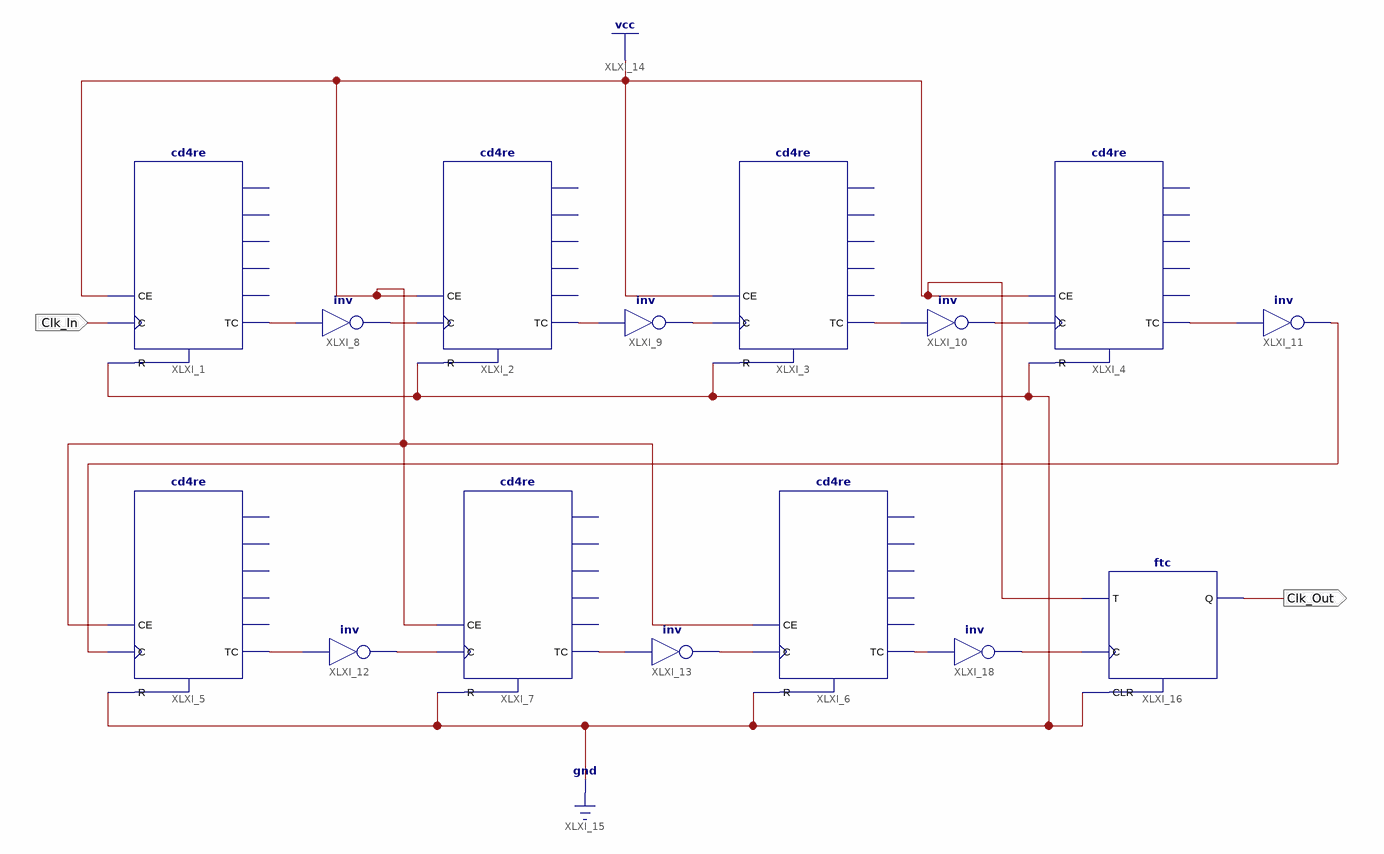
[diagram p0: schematic sheet 1]
// Xilinx ISE schematic Divider.sch (spartan6) as structural Verilog: 15 symbols, 2 ports
module Divider (
  input  Clk_In,
  output Clk_Out
);

  wire XLXN_1, XLXN_2, XLXN_3, XLXN_4, XLXN_5, XLXN_6, XLXN_7, XLXN_8, XLXN_9, XLXN_10, XLXN_11, XLXN_12,
       XLXN_30, XLXN_31;

  cd4re XLXI_1 (.C(Clk_In), .CE(1'b1), .R(1'b0), .TC(XLXN_10));  // open: CEO, Q0, Q1, Q2, Q3
  cd4re XLXI_2 (.C(XLXN_11), .CE(1'b1), .R(1'b0), .TC(XLXN_8));  // open: CEO, Q0, Q1, Q2, Q3
  cd4re XLXI_3 (.C(XLXN_9), .CE(1'b1), .R(1'b0), .TC(XLXN_6));  // open: CEO, Q0, Q1, Q2, Q3
  cd4re XLXI_4 (.C(XLXN_7), .CE(1'b1), .R(1'b0), .TC(XLXN_12));  // open: CEO, Q0, Q1, Q2, Q3
  cd4re XLXI_5 (.C(XLXN_1), .CE(1'b1), .R(1'b0), .TC(XLXN_2));  // open: CEO, Q0, Q1, Q2, Q3
  cd4re XLXI_6 (.C(XLXN_5), .CE(1'b1), .R(1'b0), .TC(XLXN_30));  // open: CEO, Q0, Q1, Q2, Q3
  cd4re XLXI_7 (.C(XLXN_3), .CE(1'b1), .R(1'b0), .TC(XLXN_4));  // open: CEO, Q0, Q1, Q2, Q3
  not XLXI_8 (XLXN_11, XLXN_10);
  not XLXI_9 (XLXN_9, XLXN_8);
  not XLXI_10 (XLXN_7, XLXN_6);
  not XLXI_11 (XLXN_1, XLXN_12);
  not XLXI_12 (XLXN_3, XLXN_2);
  not XLXI_13 (XLXN_5, XLXN_4);
  ftc XLXI_16 (.C(XLXN_31), .CLR(1'b0), .T(1'b1), .Q(Clk_Out));
  not XLXI_18 (XLXN_31, XLXN_30);
endmodule
